# Altium schematic sheet BBTC-PSU.SchDoc
size B
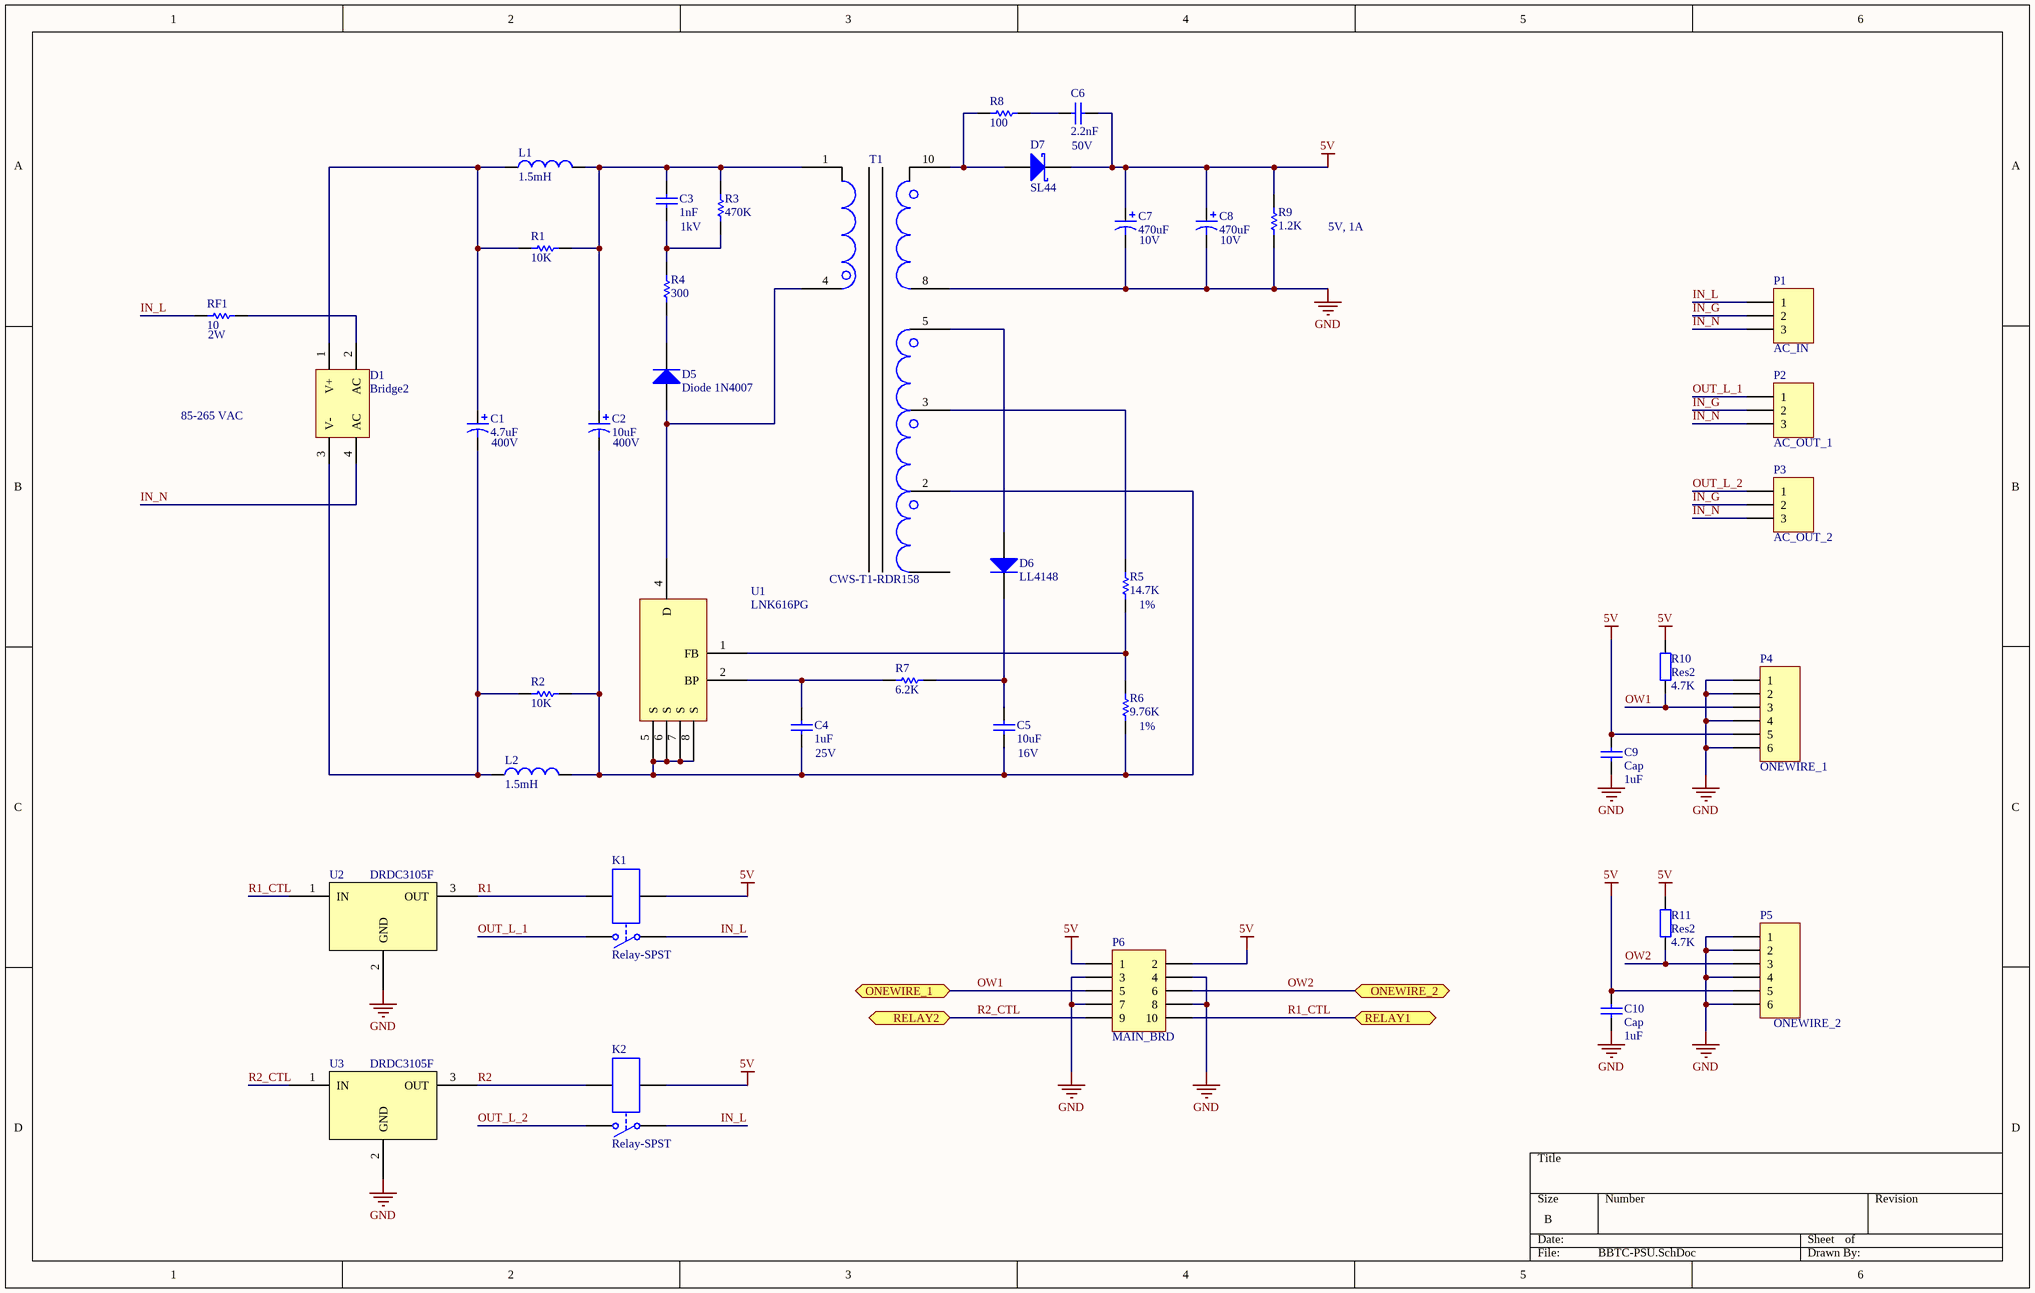
[diagram p0: BBTC-PSU.SchDoc]

## Parts
C1  4.7uF  Voltage: 400V  [CAP-10D-5L]
C2  10uF  Voltage: 400V  [CAP-12.5D-5L]
C3  1nF  Voltage: 1kV  [0805]
C4  1uF  Voltage: 25V  [0805]
C5  10uF  Voltage: 16V  [0805]
C6  2.2nF  Voltage: 50V  [0805]
C7  470uF  Voltage: 10V  [CAP-8D-3.5L]
C8  470uF  Voltage: 10V  [CAP-8D-3.5L]
C9  Cap  value 1uF  [0603]
C10  Cap  value 1uF  [0603]
D1  Bridge2  [DF1510S-E3/77]
D5  Diode 1N4007  [Diode-Wide]
D6  LL4148  [SOD-80]
D7  SL44  [DIODE_SMC]
K1  Relay-SPST  [PB134005]
K2  Relay-SPST  [PB134005]
L1  1.5mH  [TSL0808]
L2  1.5mH  [TSL0808]
P1  AC_IN  [B3P-VH(LF)(SN)]
P2  AC_OUT_1  [B3P-VH(LF)(SN)]
P3  AC_OUT_2  [B3P-VH(LF)(SN)]
P4  ONEWIRE_1  [CONN MOD JACK R/A 6P6C]
P5  ONEWIRE_2  [CONN MOD JACK R/A 6P6C]
P6  MAIN_BRD  [5X2 PIN PTH HEADER - 2MM]
R1  10K  [1206]
R2  10K  [1206]
R3  470K  [0805]
R4  300  [1206]
R5  14.7K  Tolerance: 1%  [0603]
R6  9.76K  Tolerance: 1%  [0603]
R7  6.2K  [0603]
R8  100  [0805]
R9  1.2K  [0805]
R10  Res2  value 4.7K  [0603]
R11  Res2  value 4.7K  [0603]
RF1  10  Power: 2W  [Res Wide]
T1  CWS-T1-RDR158  [CWS-T1-RDR158]
U1  LNK616PG  [LNK6XX]
U2  DRDC3105F  [SOT23]
U3  DRDC3105F  [SOT23]

## Ports
ONEWIRE_1, ONEWIRE_2, RELAY1, RELAY2

## Nets
5V: C6.1 C7.1 C8.1 C9.2 C10.2 D7.2(K) K1.3 K2.3 P4.5 P5.5 P6.1 P6.2 R9.1 R10.2 R11.2
GND: C7.2 C8.2 C9.1 C10.1 P4.1 P4.2 P4.4 P4.6 P5.1 P5.2 P5.4 P5.6 P6.3 P6.4 P6.7 P6.8 R9.2 T1.8 U2.2(GND) U3.2(GND)
IN_G: P1.2 P2.2 P3.2
IN_L: K1.1 K2.1 P1.1 RF1.1
IN_N: D1.4(AC) P1.3 P2.3 P3.3
OUT_L_1: K1.2 P2.1
OUT_L_2: K2.2 P3.1
OW1: P4.3 P6.5 R10.1 ; port ONEWIRE_1
OW2: P5.3 P6.6 R11.1 ; port ONEWIRE_2
R1: K1.4 U2.3(OUT)
R1_CTL: P6.10 U2.1(IN) ; port RELAY1
R2: K2.4 U3.3(OUT)
R2_CTL: P6.9 U3.1(IN) ; port RELAY2
NetC1_1: C1.1 D1.1(V+) L1.1 R1.1
NetC1_2: C1.2 D1.3(V-) L2.1 R2.1
NetC2_1: C2.1 C3.1 L1.2 R1.2 R3.2 T1.1
NetC2_2: C2.2 C4.2 C5.2 L2.2 R2.2 R6.2 T1.2 U1.5(S) U1.6(S) U1.7(S) U1.8(S)
NetC3_2: C3.2 R3.1 R4.2
NetC4_1: C4.1 R7.2 U1.2(BP)
NetC5_1: C5.1 D6.2(K) R7.1
NetC6_2: C6.2 R8.1
NetD1_2: D1.2(AC) RF1.2
NetD5_1: D5.1(A) T1.4 U1.4(D)
NetD5_2: D5.2(K) R4.1
NetD6_1: D6.1(A) T1.5
NetD7_1: D7.1(A) R8.2 T1.10
NetR5_1: R5.1 T1.3
NetR5_2: R5.2 R6.1 U1.1(FB)

## Notes on the sheet
- 5V, 1A
- 85-265 VAC

## Library data of the parts
C1 C2 C7 C8 = Cap Pol1: Polarized Capacitor (Radial)
  C1: Value: 4.7uF
  C2: Value: 10uF
  C7 C8: Value: 470uF
C3-C6 C9 C10 = Cap: Capacitor
  C3: Value: 1nF
  C4: Value: 1uF
  C5: Value: 10uF
  C6: Value: 2.2nF
  C9 C10: Supplier 1: Digi-Key; Supplier Part Number 1: 587-1242-1-ND
D1 = Bridge2: Diode Bridge; Supplier 1: Digi-Key; Supplier Part Number 1: DF1510S-E3/77GICT-ND
D5 = Diode 1N4007: 1 Amp General Purpose Rectifier
D6 = Diode: Default Diode
D7 = D Schottky: Schottky Diode; pin to pad: 1>2 2>1
K1 K2 = Relay-SPST: Single-Pole Single-Throw Relay; Published: 24-Mar-1999; LatestRevisionDate: 17-Jul-2002; LatestRevisionNote: Re-released for DXP Platform.; PackageReference: MODULE4; Publisher: Altium Limited
L1 L2 = Inductor: Value: 1.5mH
P1-P3 = Header 3: Header, 3-Pin; LatestRevisionDate: 17-Jul-2002; LatestRevisionNote: Re-released for DXP Platform.; Publisher: Altium Limited
P4 P5 = Header 6: Header, 6-Pin; Supplier Part Number 1: A105007CT-ND; Supplier 1: Digi-Key
P6 = Header 5X2: Header, 5-Pin, Dual row; Supplier Part Number 1: 609-3105-ND; Supplier 1: Digi-Key
R1-R9 RF1 = Res1: Resistor
  R1 R2: Value: 10K
  R3: Value: 470K
  R4: Value: 300
  R5: Value: 14.7K
  R6: Value: 9.76K
  R7: Value: 6.2K
  R8: Value: 100
  R9: Value: 1.2K
  RF1: Value: 10
R10 R11 = Res2: Resistor; Supplier 1: Digi-Key; Supplier Part Number 1: 311-4.7KGRCT-ND
T1 = CWS-T1-RDR158: Flyback transformer
U1 = LNK616PG: Energy-Efficient, Accurate CV/CC Switcher  for Adapters and Chargers
U2 U3 = DRDC3105F: INTEGRATED RELAY, INDUCTIVE LOAD DRIVER; Supplier Part Number 1: DRDC3105F-7DICT-ND; Supplier 1: Digi-Key